# EAGLE design controller-v2 (EAGLE 7.5.0)
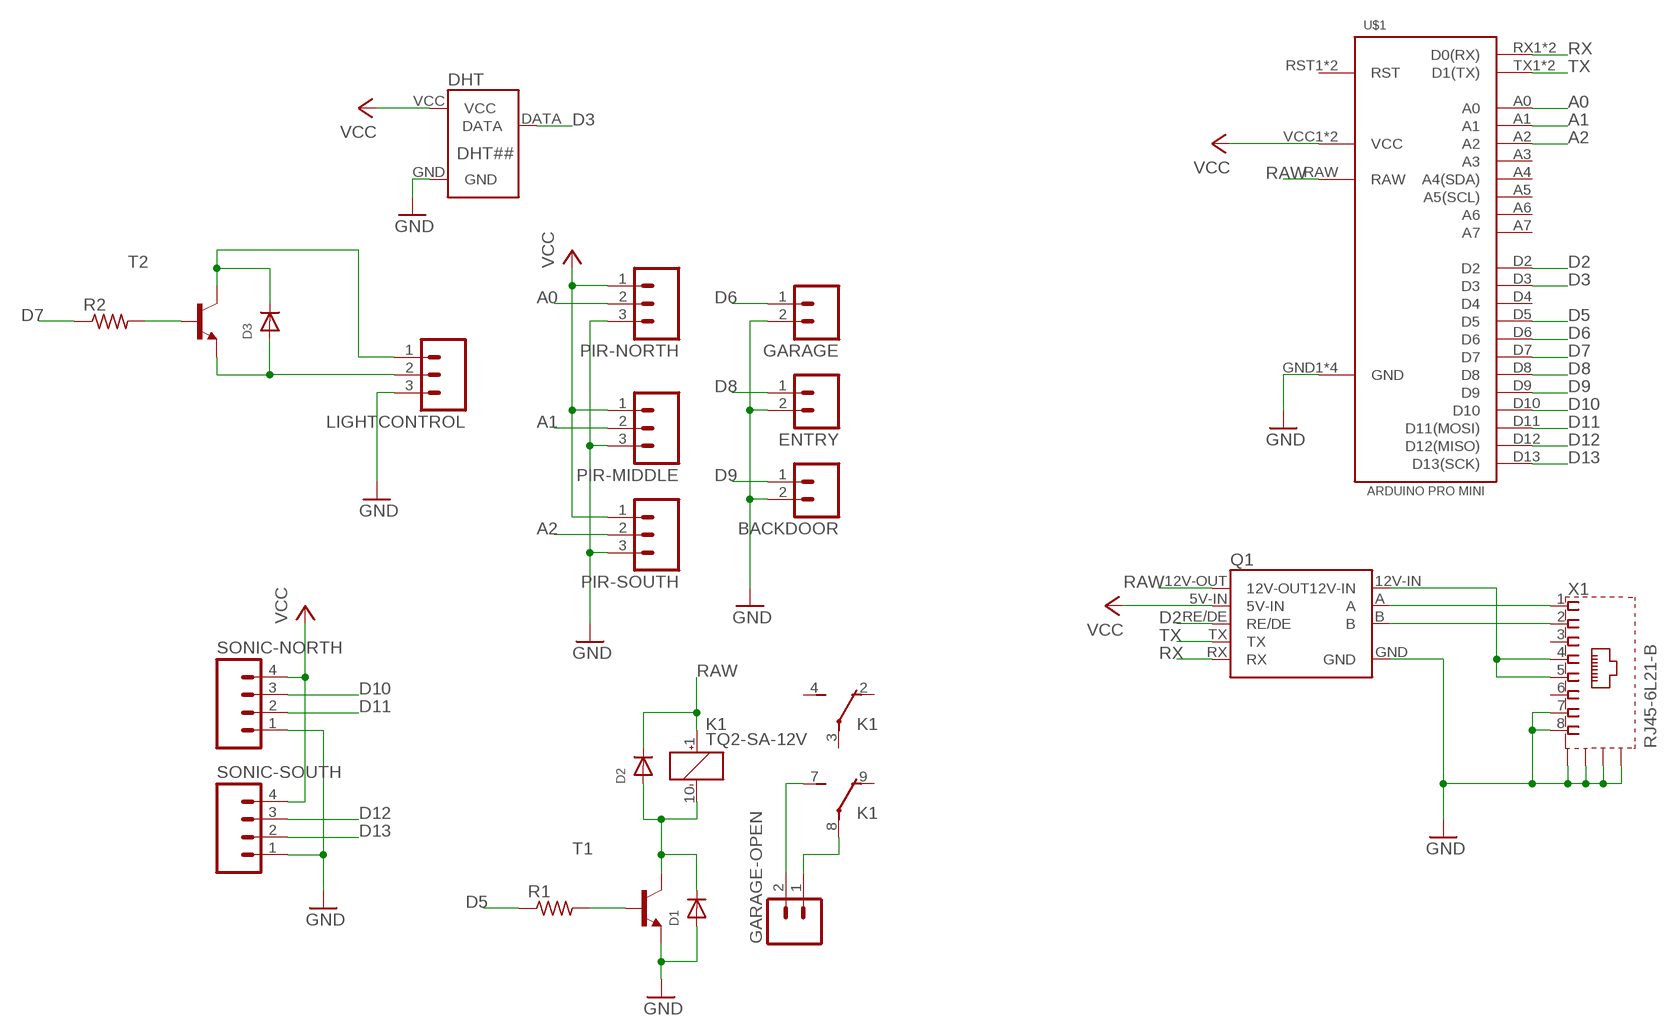
[diagram p0: schematic, sheet 1]

## Parts
BACKDOOR  M02  [02P]
D1  DIODESMA  [SMADIODE]
D2  DIODESMA  [SMADIODE]
D3  DIODESMA  [SMADIODE]
DHT  DHT##  [CONNECTOR-4-PIN-0.1]
ENTRY  M02  [02P]
GARAGE  M02  [02P]
GARAGE-OPEN  M02  [02P]
K1  TQ2-SA-12V  [TQ-SA]
LIGHTCONTROL  M03  [03P]
PIR-MIDDLE  M03  [03P]
PIR-NORTH  M03  [03P]
PIR-SOUTH  M03  [03P]
Q1  RS485-ADAPTER0.05-CONNECTOR  [RS485-ADAPTOR-05]
R1  R-US_R0603  [R0603]
R2  R-US_R0603  [R0603]
SONIC-NORTH  M04  [04P]
SONIC-SOUTH  M04  [04P]
T1  BC808-NPN-SOT23-BEC  [SOT23-BEC]
T2  BC808-NPN-SOT23-BEC  [SOT23-BEC]
U$1  ARDUINO-PRO-MINI  [ARDUINO-PRO-MINI]
X1  RJ45-6L21-B  [RJ45-SHIELD1]

## Nets
A0: PIR-NORTH.2 U$1.A0
A1: PIR-MIDDLE.2 U$1.A1
A2: PIR-SOUTH.2 U$1.A2
D2: Q1.RE/DE U$1.D2
D3: DHT.DATA U$1.D3
D5: R1.1 U$1.D5
D6: GARAGE.1 U$1.D6
D7: R2.1 U$1.D7
D8: ENTRY.1 U$1.D8
D9: BACKDOOR.1 U$1.D9
D10: SONIC-NORTH.3 U$1.D10
D11: SONIC-NORTH.2 U$1.D11(D11(MOSI))
D12: SONIC-SOUTH.3 U$1.D12(D12(MISO))
D13: SONIC-SOUTH.2 U$1.D13(D13(SCK))
GND: BACKDOOR.2 D1.A DHT.GND ENTRY.2 GARAGE.2 LIGHTCONTROL.3 PIR-MIDDLE.3 PIR-NORTH.3 PIR-SOUTH.3 Q1.GND SONIC-NORTH.1 SONIC-SOUTH.1 T1.E U$1.GND1(GND) U$1.GND2(GND) U$1.GND3(GND) U$1.GND4(GND) X1.7 X1.8 X1.S1(S) X1.S2(S) X1.S3(S) X1.S4(S)
N$1: D3.A LIGHTCONTROL.2 T2.E
N$8: Q1.12V-IN X1.4 X1.5
N$9: GARAGE-OPEN.1 K1.8(2:P)
N$10: Q1.A X1.1
N$11: Q1.B X1.2
N$12: GARAGE-OPEN.2 K1.7(2:S)
N$13: D1.C D2.A K1.10(_:-) T1.C
N$14: R1.2 T1.B
N$21: D3.C LIGHTCONTROL.1 T2.C
N$22: R2.2 T2.B
RAW: D2.C K1.1(_:+) Q1.12V-OUT U$1.RAW
RX: Q1.RX U$1.RX1(D0(RX)) U$1.RX2(D0(RX))
TX: Q1.TX U$1.TX1(D1(TX)) U$1.TX2(D1(TX))
VCC: DHT.VCC PIR-MIDDLE.1 PIR-NORTH.1 PIR-SOUTH.1 Q1.5V-IN SONIC-NORTH.4 SONIC-SOUTH.4 U$1.VCC1(VCC) U$1.VCC2(VCC)
Unconnected: K1.2(1:O) K1.3(1:P) K1.4(1:S) K1.9(2:O) U$1.A3 U$1.A4(A4(SDA)) U$1.A5(A5(SCL)) U$1.A6 U$1.A7 U$1.D4 U$1.RST1(RST) U$1.RST2(RST) X1.3 X1.6

## Library data of the parts
BACKDOOR ENTRY GARAGE GARAGE-OPEN = con-amp-quick:M02: AMP QUICK CONNECTOR; OC_FARNELL: unknown; OC_NEWARK: unknown
D1-D3 = adafruit:DIODE: Diode SMADIODE - SMA Surface Mount Package 20V 1A Schottky Diode Digikey: 641-1014-6-ND DO-1N4148 - Through Hole Small Current Diode SOD-123 20V 1 A (.5mV Vf) Schottky Diode - Digikey: MBRX120TPMSCT-ND SOD-323 10V 570mA (.38mV Vf, 3ns) Schottky Diode - Digikey: ZLLS410CT-ND SOD-523 30V 30mA Schottky Diode (RB751S-40TE61) - Digikey: RB751S-40TE61CT-ND SOT23-R/W - SOT23 Package (R = Solder Paste/Reflow Ovens, W = Hand-Soldering) BAT54Film 40V 300mA - Digikey: 497-7162-1-ND
DHT = serge:DHT##
K1 = relay:TQ2?*: LOW PROFILE 2 FORM C RELAY NAiS Source: http://www.mew-europe.com/.. en_ds_61020_0001.pdf Source: http://www.mew-europe.com/.. en_ds_61020_0004.pdf; MF: AROMAT/ MATSUSHITA; MPN: TQ2SA-12V; OC_FARNELL: 1124056; OC_NEWARK: 64K3203
LIGHTCONTROL PIR-MIDDLE PIR-NORTH PIR-SOUTH = con-amp-quick:M03: AMP QUICK CONNECTOR; OC_FARNELL: unknown; OC_NEWARK: unknown
Q1 = serge:RS485-ADAPTER
R1 R2 = adafruit:R-US_: RESISTOR, American symbol
SONIC-NORTH SONIC-SOUTH = con-amp-quick:M04: AMP QUICK CONNECTOR; OC_FARNELL: unknown; OC_NEWARK: unknown
T1 T2 = transistor:*-NPN-: NPN Transistror BF959 corrected 2008.03.06
U$1 = serge:ARDUINO-PRO-MINI
X1 = con-tycoelectronics:RJ45*2: RJ45 Low Profile Shield Type 2 For all RJ45 L, LC, LCT and X Series Models Source: www.tycoelectronics.com .. ENG_DS_1654001_1099_RJ_L_0507.pdf; OC_FARNELL: unknown; OC_NEWARK: unknown

## Board
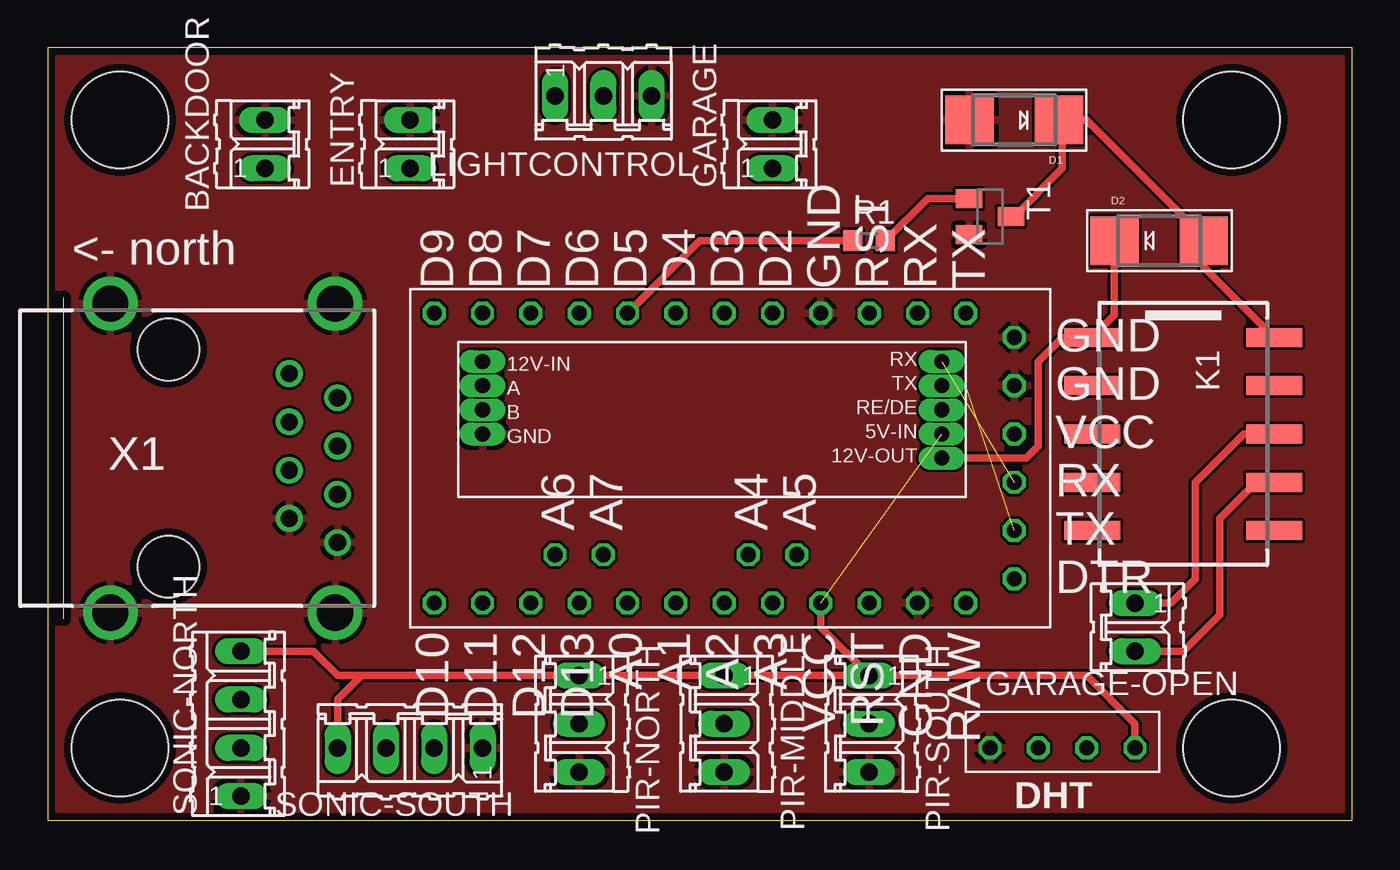
[diagram p1: board, top side]
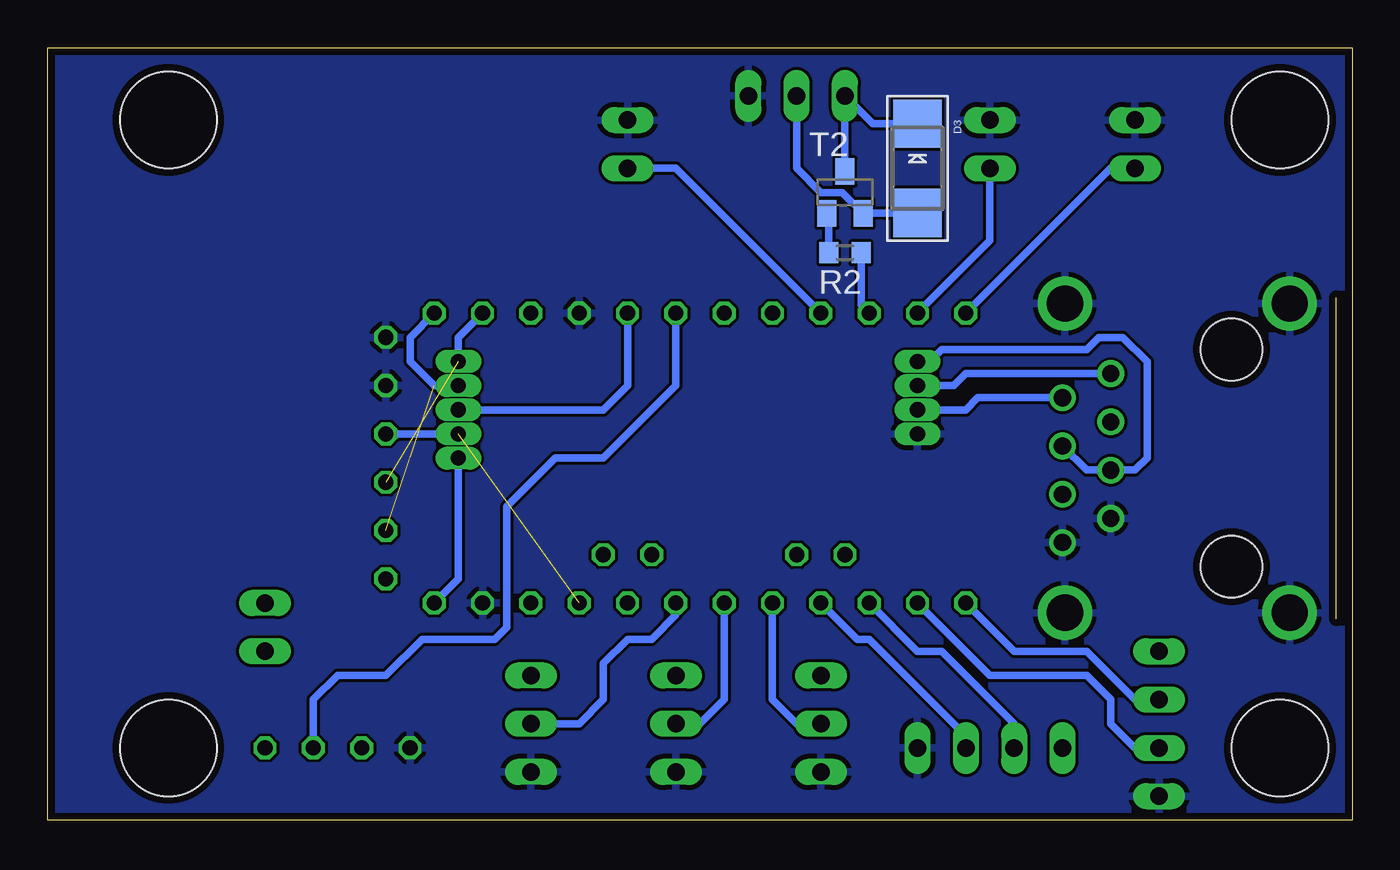
[diagram p2: board, bottom side, seen from below]

Size 68.58 x 40.64 mm. Coordinates in mm from the lower left corner, seen from the top.
Outline: 0,0 68.58,0 68.58,40.64 0,40.64 0,0
Copper layers (1*16): Top 0.0356mm / dielectric 1.5011mm / Bottom 0.0356mm
Design rules "LaenPCBOrder": minimum track width 6mil, minimum drill 13mil, track to track 6mil, track to pad 6mil, pad to pad 6mil, via to via 6mil, smd to smd 6mil, copper to edge 15mil, drill to drill 6mil, minimum pad ring 7mil, minimum via ring 7mil, stop-mask expansion 4mil, vias tented up to drill 0mil, thermal gap 10mil
Holes 5.08 mm at 3.81,3.81 3.81,36.83 62.23,36.83 62.23,3.81

### Footprints (pad centres in the part's own frame; a part is rotated, then mirrored left to right if it is on the bottom)
02P = drill 0.914 long: 1 -1.27,0; 2 1.27,0
SMADIODE = smd 2.54 x 2.54: A 2.349,0; C -2.349,0
CONNECTOR-4-PIN-0.1 = drill 0.8 octagon: DATA -1.27,0; GND 3.81,0; N/C 1.27,0; VCC -3.81,0
TQ-SA = smd 1 x 2.94: 1 -5.08,-4.78; 2 -2.54,-4.78; 3 0,-4.78; 4 2.54,-4.78; 5 5.08,-4.78; 6 5.08,4.78; 7 2.54,4.78; 8 0,4.78; 9 -2.54,4.78; 10 -5.08,4.78
03P = drill 0.914 long: 1 -2.54,0; 2 0,0; 3 2.54,0
RS485-ADAPTOR-05 = drill 0.8 pad 1.016 long: 5V-IN -11.43,1.27; 12V-IN 12.7,-2.54; 12V-OUT -11.43,2.54; A 12.7,-1.27; B 12.7,0; GND 12.7,1.27; RE/DE -11.43,0; RX -11.43,-2.54; TX -11.43,-1.27
R0603 = smd 1 x 1.1: 1 -0.85,0; 2 0.85,0
04P = drill 0.914 long: 1 -3.81,0; 2 -1.27,0; 3 1.27,0; 4 3.81,0
SOT23-BEC = smd 1 x 1.4: B -0.95,-1.1; C 0,1.1; E 0.95,-1.1
ARDUINO-PRO-MINI = drill 0.8 octagon: A0 -3.81,-7.62; A1 -1.27,-7.62; A2 1.27,-7.62; A3 3.81,-7.62; A4 2.54,-5.08; A5 5.08,-5.08; A6 -7.62,-5.08; A7 -5.08,-5.08; D2 3.81,7.62; D3 1.27,7.62; D4 -1.27,7.62; D5 -3.81,7.62; D6 -6.35,7.62; D7 -8.89,7.62; D8 -11.43,7.62; D9 -13.97,7.62; D10 -13.97,-7.62; D11 -11.43,-7.62; D12 -8.89,-7.62; D13 -6.35,-7.62; DTR 16.51,-6.35; GND1 11.43,-7.62; GND2 16.51,6.35; GND3 16.51,3.81; GND4 6.35,7.62; RAW 13.97,-7.62; RST1 8.89,7.62; RST2 8.89,-7.62; RX1 11.43,7.62; RX2 16.51,-1.27; TX1 13.97,7.62; TX2 16.51,-3.81; VCC1 16.51,1.27; VCC2 6.35,-7.62
RJ45-SHIELD1 = drill 0.9 pad 1.4: 1 -4.445,6.35; 2 -3.175,8.89; 3 -1.905,6.35; 4 -0.635,8.89; 5 0.635,6.35; 6 1.905,8.89; 7 3.175,6.35; 8 4.445,8.89 | drill 1.9 pad 2.5: S1 -8.128,-3.048; S2 8.128,-3.048; S3 -8.128,8.76; S4 8.128,8.76 | hole 3.251: -5.715,0; 5.715,0

### Placement (x,y rotation side)
BACKDOOR  11.43,35.56 90 top
D1  50.8,36.83 180 top
D2  58.42,30.48 0 top
D3  22.86,34.29 270 bottom
DHT  53.34,3.81 180 top
ENTRY  19.05,35.56 90 top
GARAGE  38.1,35.56 90 top
GARAGE-OPEN  57.15,10.16 270 top
K1  59.69,20.32 270 top
LIGHTCONTROL  29.21,38.1 0 top
PIR-MIDDLE  35.56,5.08 270 top
PIR-NORTH  27.94,5.08 270 top
PIR-SOUTH  43.18,5.08 270 top
Q1  35.56,21.59 180 top
R1  43.18,30.48 0 top
R2  26.67,29.84 180 bottom
SONIC-NORTH  10.16,5.08 90 top
SONIC-SOUTH  19.05,3.81 180 top
T1  49.53,31.75 270 top
T2  26.67,33.02 0 bottom
U$1  34.29,19.05 0 top
X1  6.35,19.05 270 top

### Tracks (layer width: path | path; a pad name or v marks a point on that pad's centre or on a via)
A0
  Bottom 0.406: PIR-NORTH.2 29.21,5.08 30.48,6.35 U$1.A0
A1
  Bottom 0.406: PIR-MIDDLE.2 34.29,5.08 33.02,6.35 U$1.A1
A2
  Bottom 0.406: PIR-SOUTH.2 40.64,5.08 39.37,6.35 39.37,8.26 38.1,9.53 36.83,9.53 35.56,10.79 U$1.A2
D2
  Bottom 0.406: U$1.D2 38.1,22.86 39.37,21.59 Q1.RE/DE
D3
  Bottom 0.406: U$1.D3 35.56,22.86 39.37,19.05 41.91,19.05 44.45,16.51 44.45,10.16 45.09,9.53 48.9,9.53 50.8,7.62 53.34,7.62 54.61,6.35 DHT.DATA
D5
  Top 0.406: R1.1 34.29,30.48 U$1.D5
D6
  Bottom 0.406: GARAGE.1 35.56,34.29 U$1.D6
D7
  Bottom 0.406: R2.1 25.82,27.09 U$1.D7
D8
  Bottom 0.406: ENTRY.1 19.05,30.48 U$1.D8
D9
  Bottom 0.406: U$1.D9 12.7,34.29 BACKDOOR.1
D10
  Bottom 0.406: U$1.D10 17.78,8.89 13.97,8.89 11.43,6.35 SONIC-NORTH.3
D11
  Bottom 0.406: SONIC-NORTH.2 11.43,3.81 12.7,5.08 12.7,6.35 13.97,7.62 19.05,7.62 U$1.D11
D12
  Bottom 0.406: SONIC-SOUTH.3 17.78,5.08 21.59,8.89 22.86,8.89 U$1.D12
D13
  Bottom 0.406: SONIC-SOUTH.2 20.32,4.45 25.4,9.53 26.04,9.53 U$1.D13
GND
  pour Bottom: 0,40.64 68.58,40.64 68.58,0 0,0
  pour Top: 0,40.64 68.58,40.64 68.58,0 0,0
N$1
  Bottom 0.406: D3.A 22.88,31.92 T2.E 26.82,33.02 27.94,33.02 29.21,34.29 LIGHTCONTROL.2
N$8
  Bottom 0.406: Q1.12V-IN 22.23,24.13 21.59,24.77 13.97,24.77 13.34,25.4 12.06,25.4 10.79,24.13 10.79,19.05 11.43,18.41 X1.5 13.97,18.41 X1.4
N$9
  Top 0.406: K1.8 62.87,20.32 60.33,17.78 60.33,12.7 59.05,11.43 GARAGE-OPEN.1
N$10
  Bottom 0.406: X1.1 20.32,23.5 20.95,22.86 Q1.A
N$11
  Bottom 0.406: X1.2 19.68,22.23 20.32,21.59 Q1.B
N$12
  Top 0.406: K1.7 63.5,17.78 61.59,15.88 61.59,10.79 59.69,8.89 GARAGE-OPEN.2
N$13
  Top 0.406: K1.10 60.77,29.1 D2.A 60.77,30.67 54.61,36.83 D1.C 53.34,36.64 53.34,34.29 50.8,31.75 T1.C
N$14
  Top 0.406: T1.B 46.25,32.7 R1.2
N$21
  Bottom 0.406: T2.C LIGHTCONTROL.1 25.21,36.64 D3.C
N$22
  Bottom 0.406: R2.2 27.52,31.82 T2.B
RAW
  Top 0.406: D2.C 56.07,26.56 K1.1 53.34,25.4 52.07,24.13 52.07,19.68 51.44,19.05 Q1.12V-OUT
  Bottom 0.406: Q1.12V-OUT 46.99,12.7 U$1.RAW
RX  (1 unrouted)
  Bottom 0.406: Q1.RX 46.99,25.4 U$1.RX1
TX  (1 unrouted)
  Bottom 0.406: Q1.TX 48.26,22.86 49.53,24.13 49.53,25.4 U$1.TX1
VCC  (1 unrouted)
  Top 0.406: DHT.VCC 57.15,5.08 54.61,7.62 PIR-SOUTH.1 | PIR-SOUTH.1 PIR-MIDDLE.1 PIR-NORTH.1 16.51,7.62 | 16.51,7.62 15.24,6.35 SONIC-SOUTH.4 | SONIC-NORTH.4 13.97,8.89 15.24,7.62 16.51,7.62 | U$1.VCC2 40.64,10.16 PIR-SOUTH.1
  Bottom 0.406: Q1.5V-IN U$1.VCC1

### Text on the board
tNames: <- north | DHT